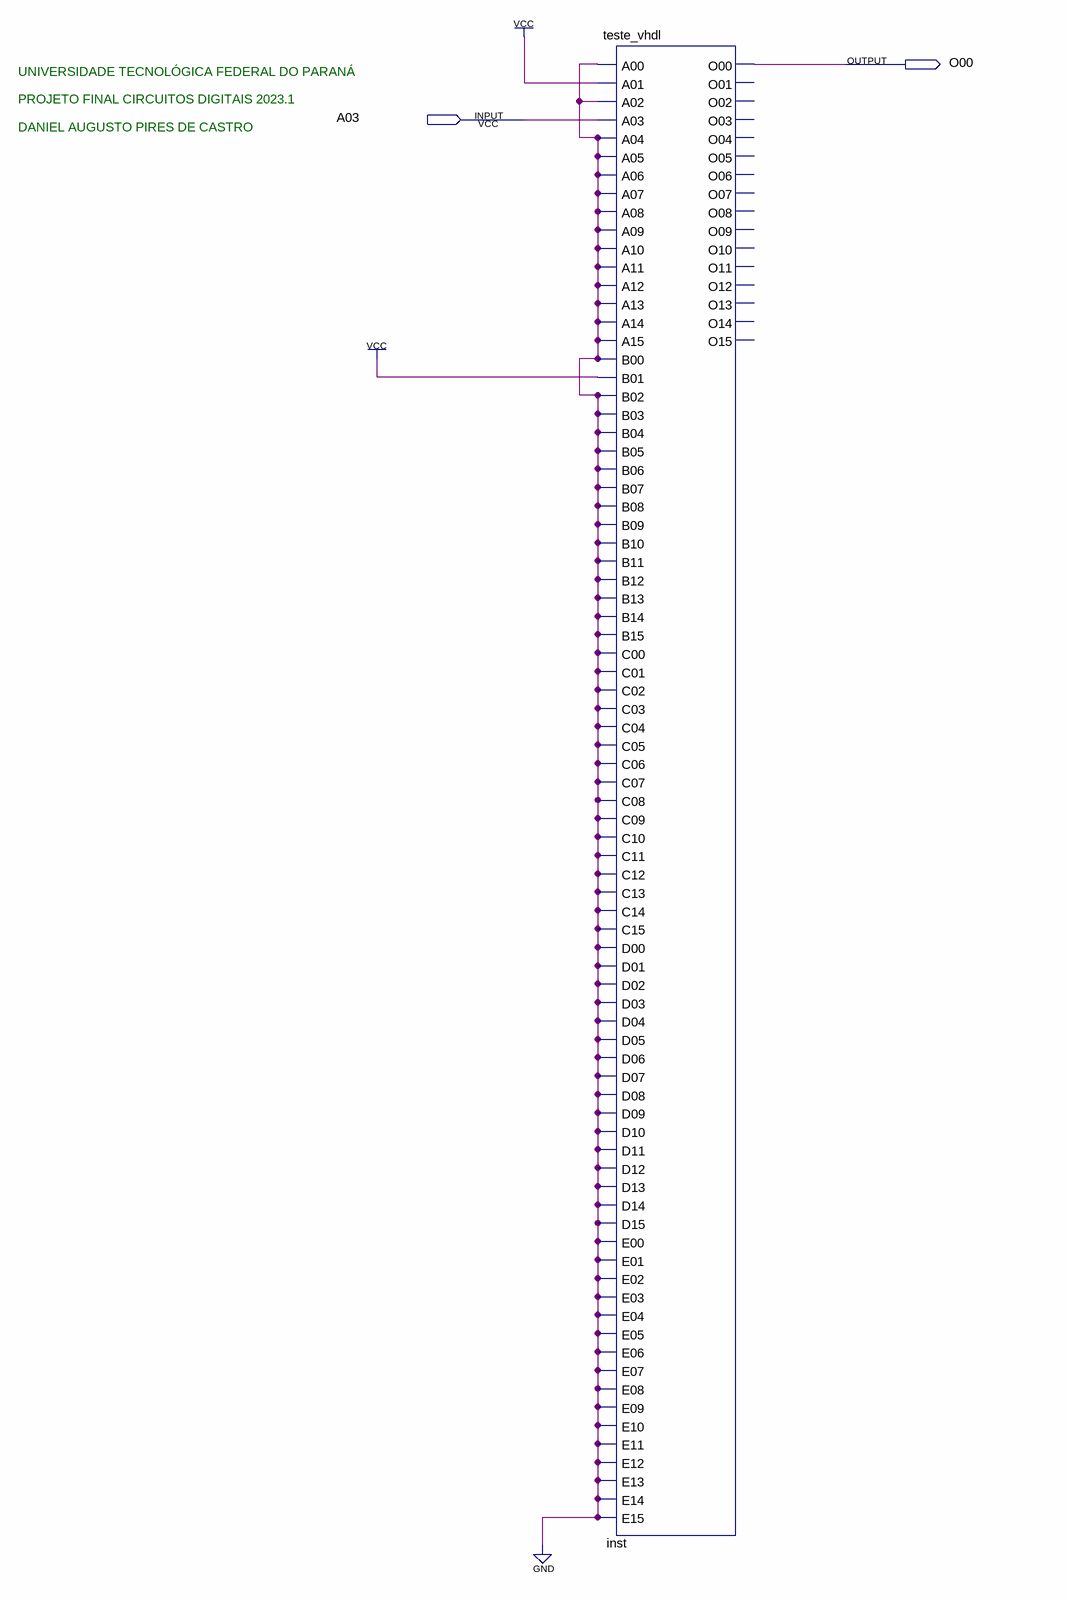
[diagram p0: schematic sheet]
// Quartus schematic teste_atributos.bdf as structural Verilog: 1 symbols, 2 pins
module teste_atributos (
  input  A03,
  output O00
);

  teste_vhdl inst (
    .A00(1'b0), .A01(1'b1), .A02(1'b0), .A03(A03), .A04(1'b0), .A05(1'b0), .A06(1'b0), .A07(1'b0),
    .A08(1'b0), .A09(1'b0), .A10(1'b0), .A11(1'b0), .A12(1'b0), .A13(1'b0), .A14(1'b0), .A15(1'b0),
    .B00(1'b0), .B01(1'b1), .B02(1'b0), .B03(1'b0), .B04(1'b0), .B05(1'b0), .B06(1'b0), .B07(1'b0),
    .B08(1'b0), .B09(1'b0), .B10(1'b0), .B11(1'b0), .B12(1'b0), .B13(1'b0), .B14(1'b0), .B15(1'b0),
    .C00(1'b0), .C01(1'b0), .C02(1'b0), .C03(1'b0), .C04(1'b0), .C05(1'b0), .C06(1'b0), .C07(1'b0),
    .C08(1'b0), .C09(1'b0), .C10(1'b0), .C11(1'b0), .C12(1'b0), .C13(1'b0), .C14(1'b0), .C15(1'b0),
    .D00(1'b0), .D01(1'b0), .D02(1'b0), .D03(1'b0), .D04(1'b0), .D05(1'b0), .D06(1'b0), .D07(1'b0),
    .D08(1'b0), .D09(1'b0), .D10(1'b0), .D11(1'b0), .D12(1'b0), .D13(1'b0), .D14(1'b0), .D15(1'b0),
    .E00(1'b0), .E01(1'b0), .E02(1'b0), .E03(1'b0), .E04(1'b0), .E05(1'b0), .E06(1'b0), .E07(1'b0),
    .E08(1'b0), .E09(1'b0), .E10(1'b0), .E11(1'b0), .E12(1'b0), .E13(1'b0), .E14(1'b0), .E15(1'b0), .O00(O00));  // open: O01, O02, O03, O04, O05, O06, O07, O08, O09, O10, O11, O12, O13, O14, O15

  // Notes on the sheet:
  //   UNIVERSIDADE TECNOLÓGICA FEDERAL DO PARANÁ
  //   PROJETO FINAL CIRCUITOS DIGITAIS 2023.1
  //   DANIEL AUGUSTO PIRES DE CASTRO
endmodule
